# EasyEDA Pro project RK3568_DEV.epro, schematic Schematic1, sheets 25 to 27 of 27

## Sheets
25 RK809-5: Create Date: 2025-09-11; Page Name: RK809-5; Project Name: RK3568B2地瓜派; Update Date: 2025-09-11
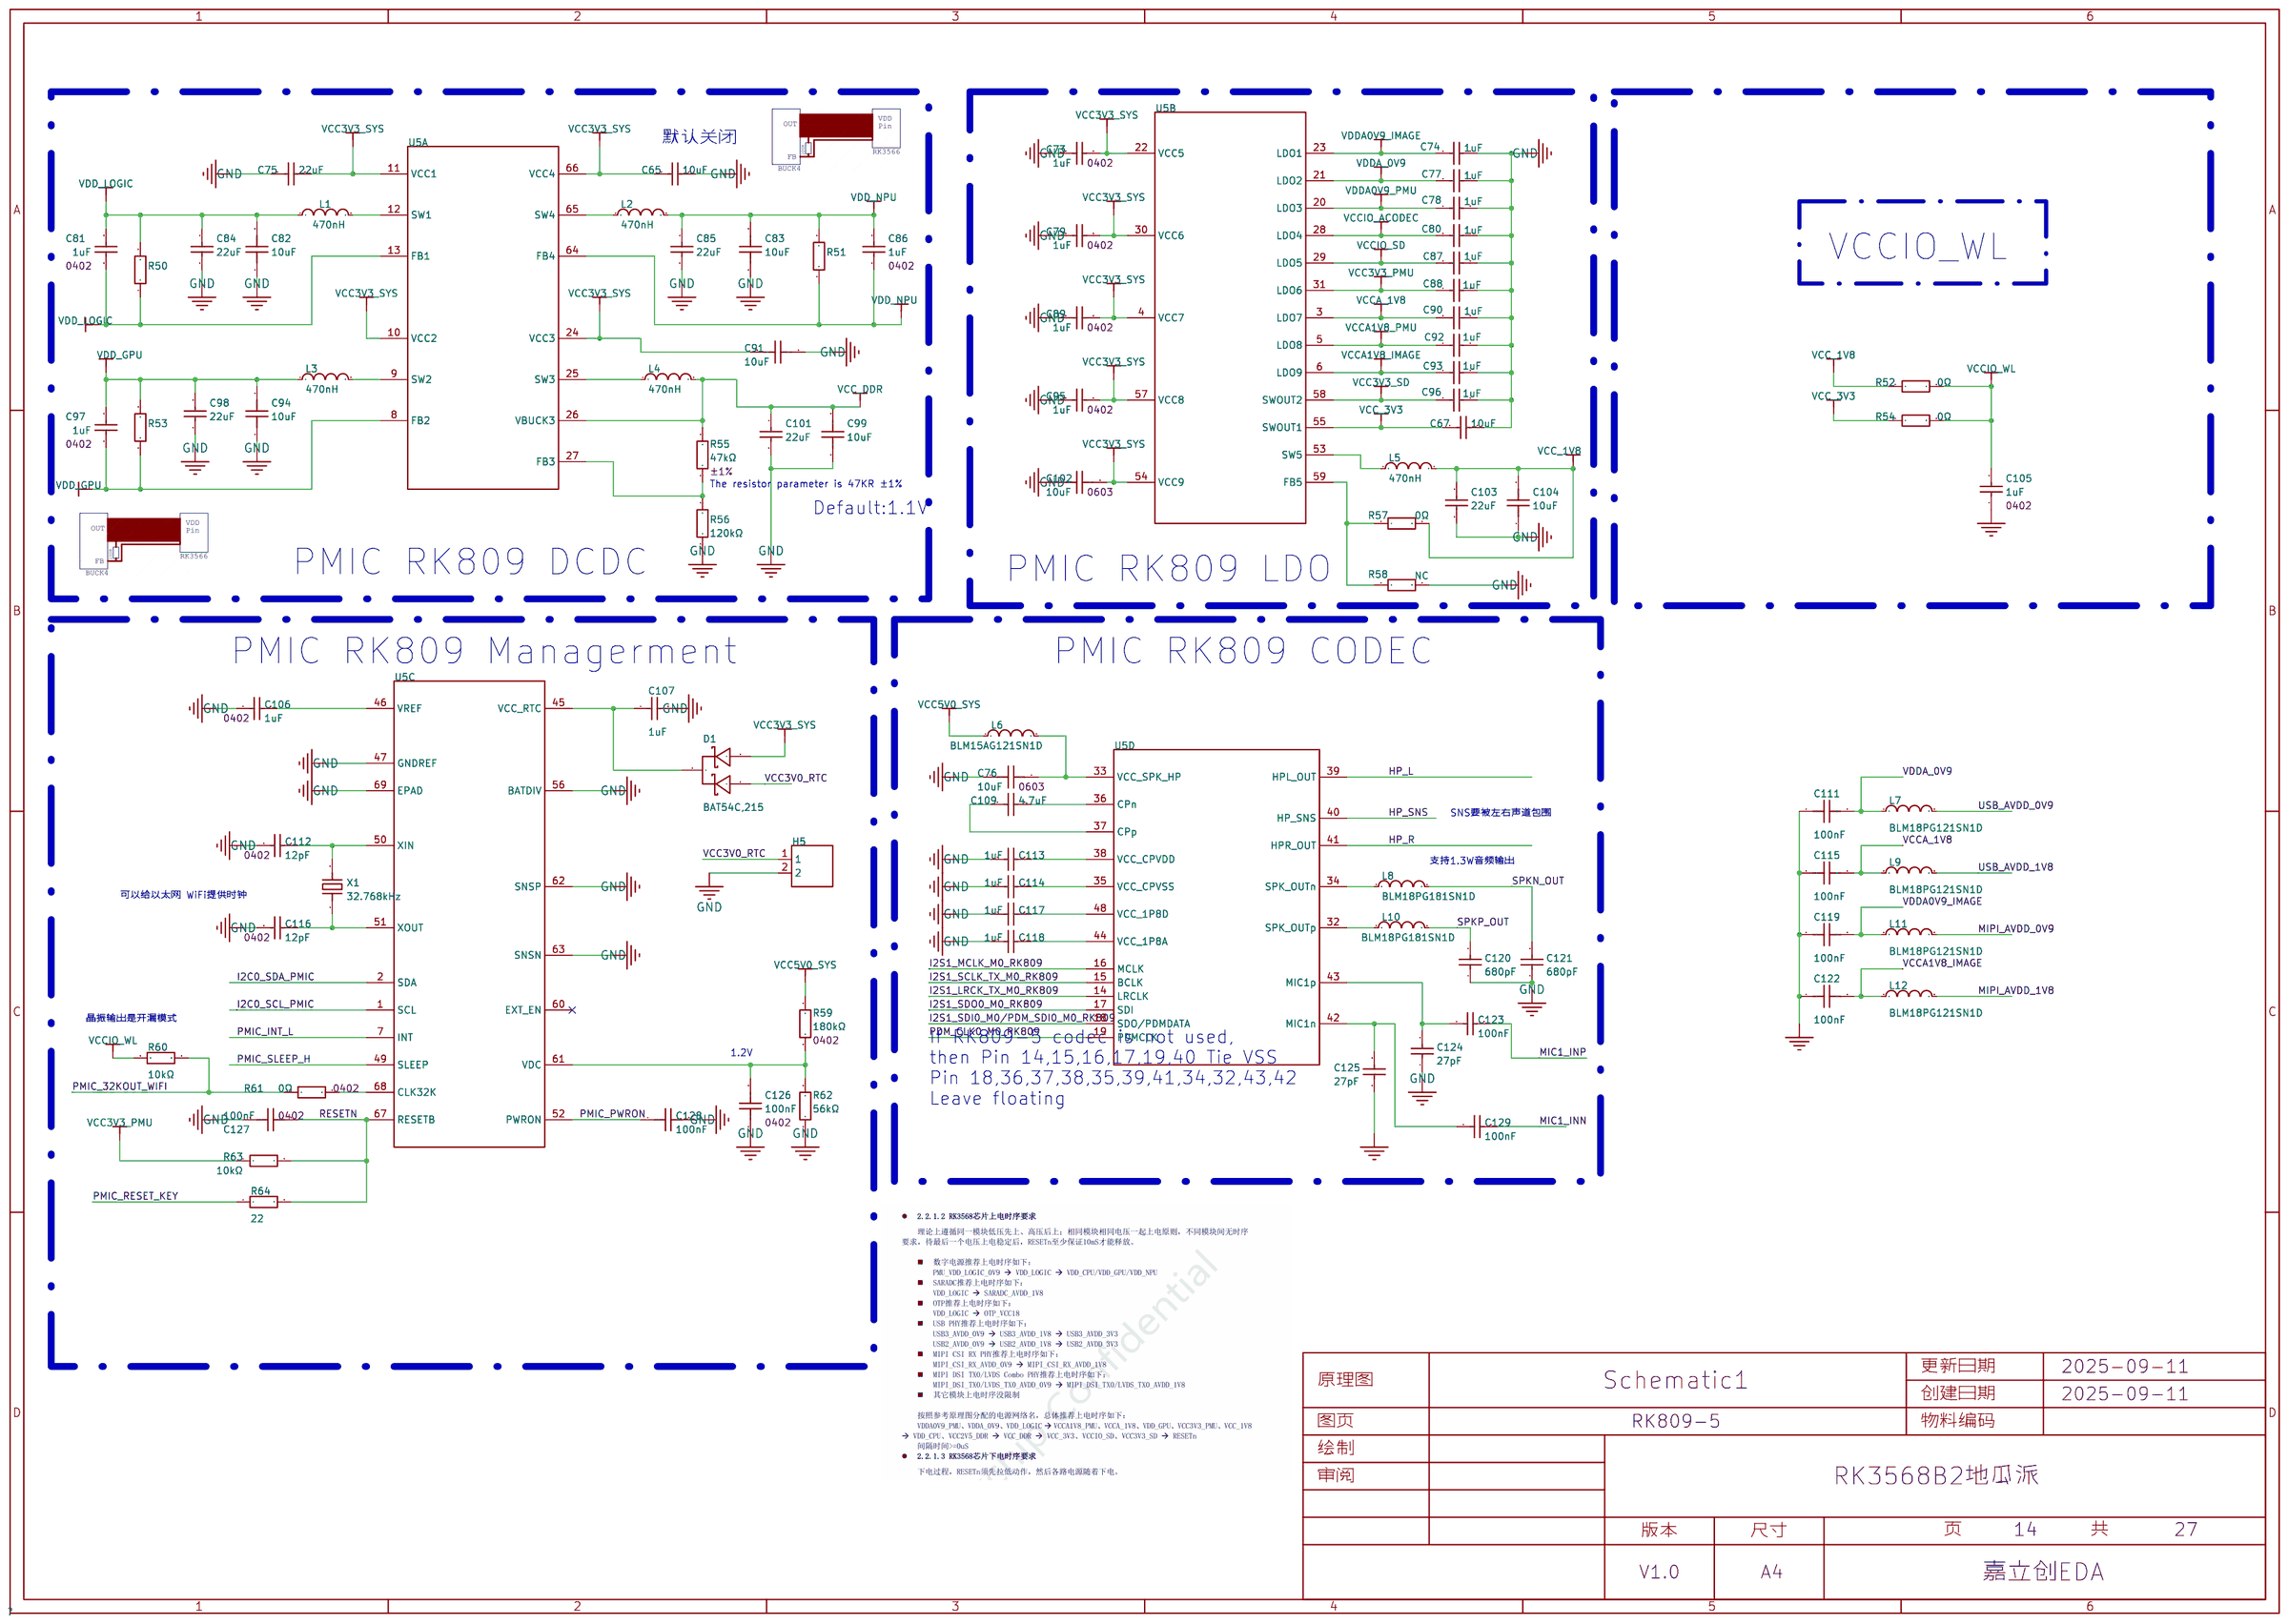
[diagram p24: RK809-5]
26 DCDC: Create Date: 2025-09-11; Page Name: DCDC; Project Name: RK3568B2地瓜派; Update Date: 2025-09-13
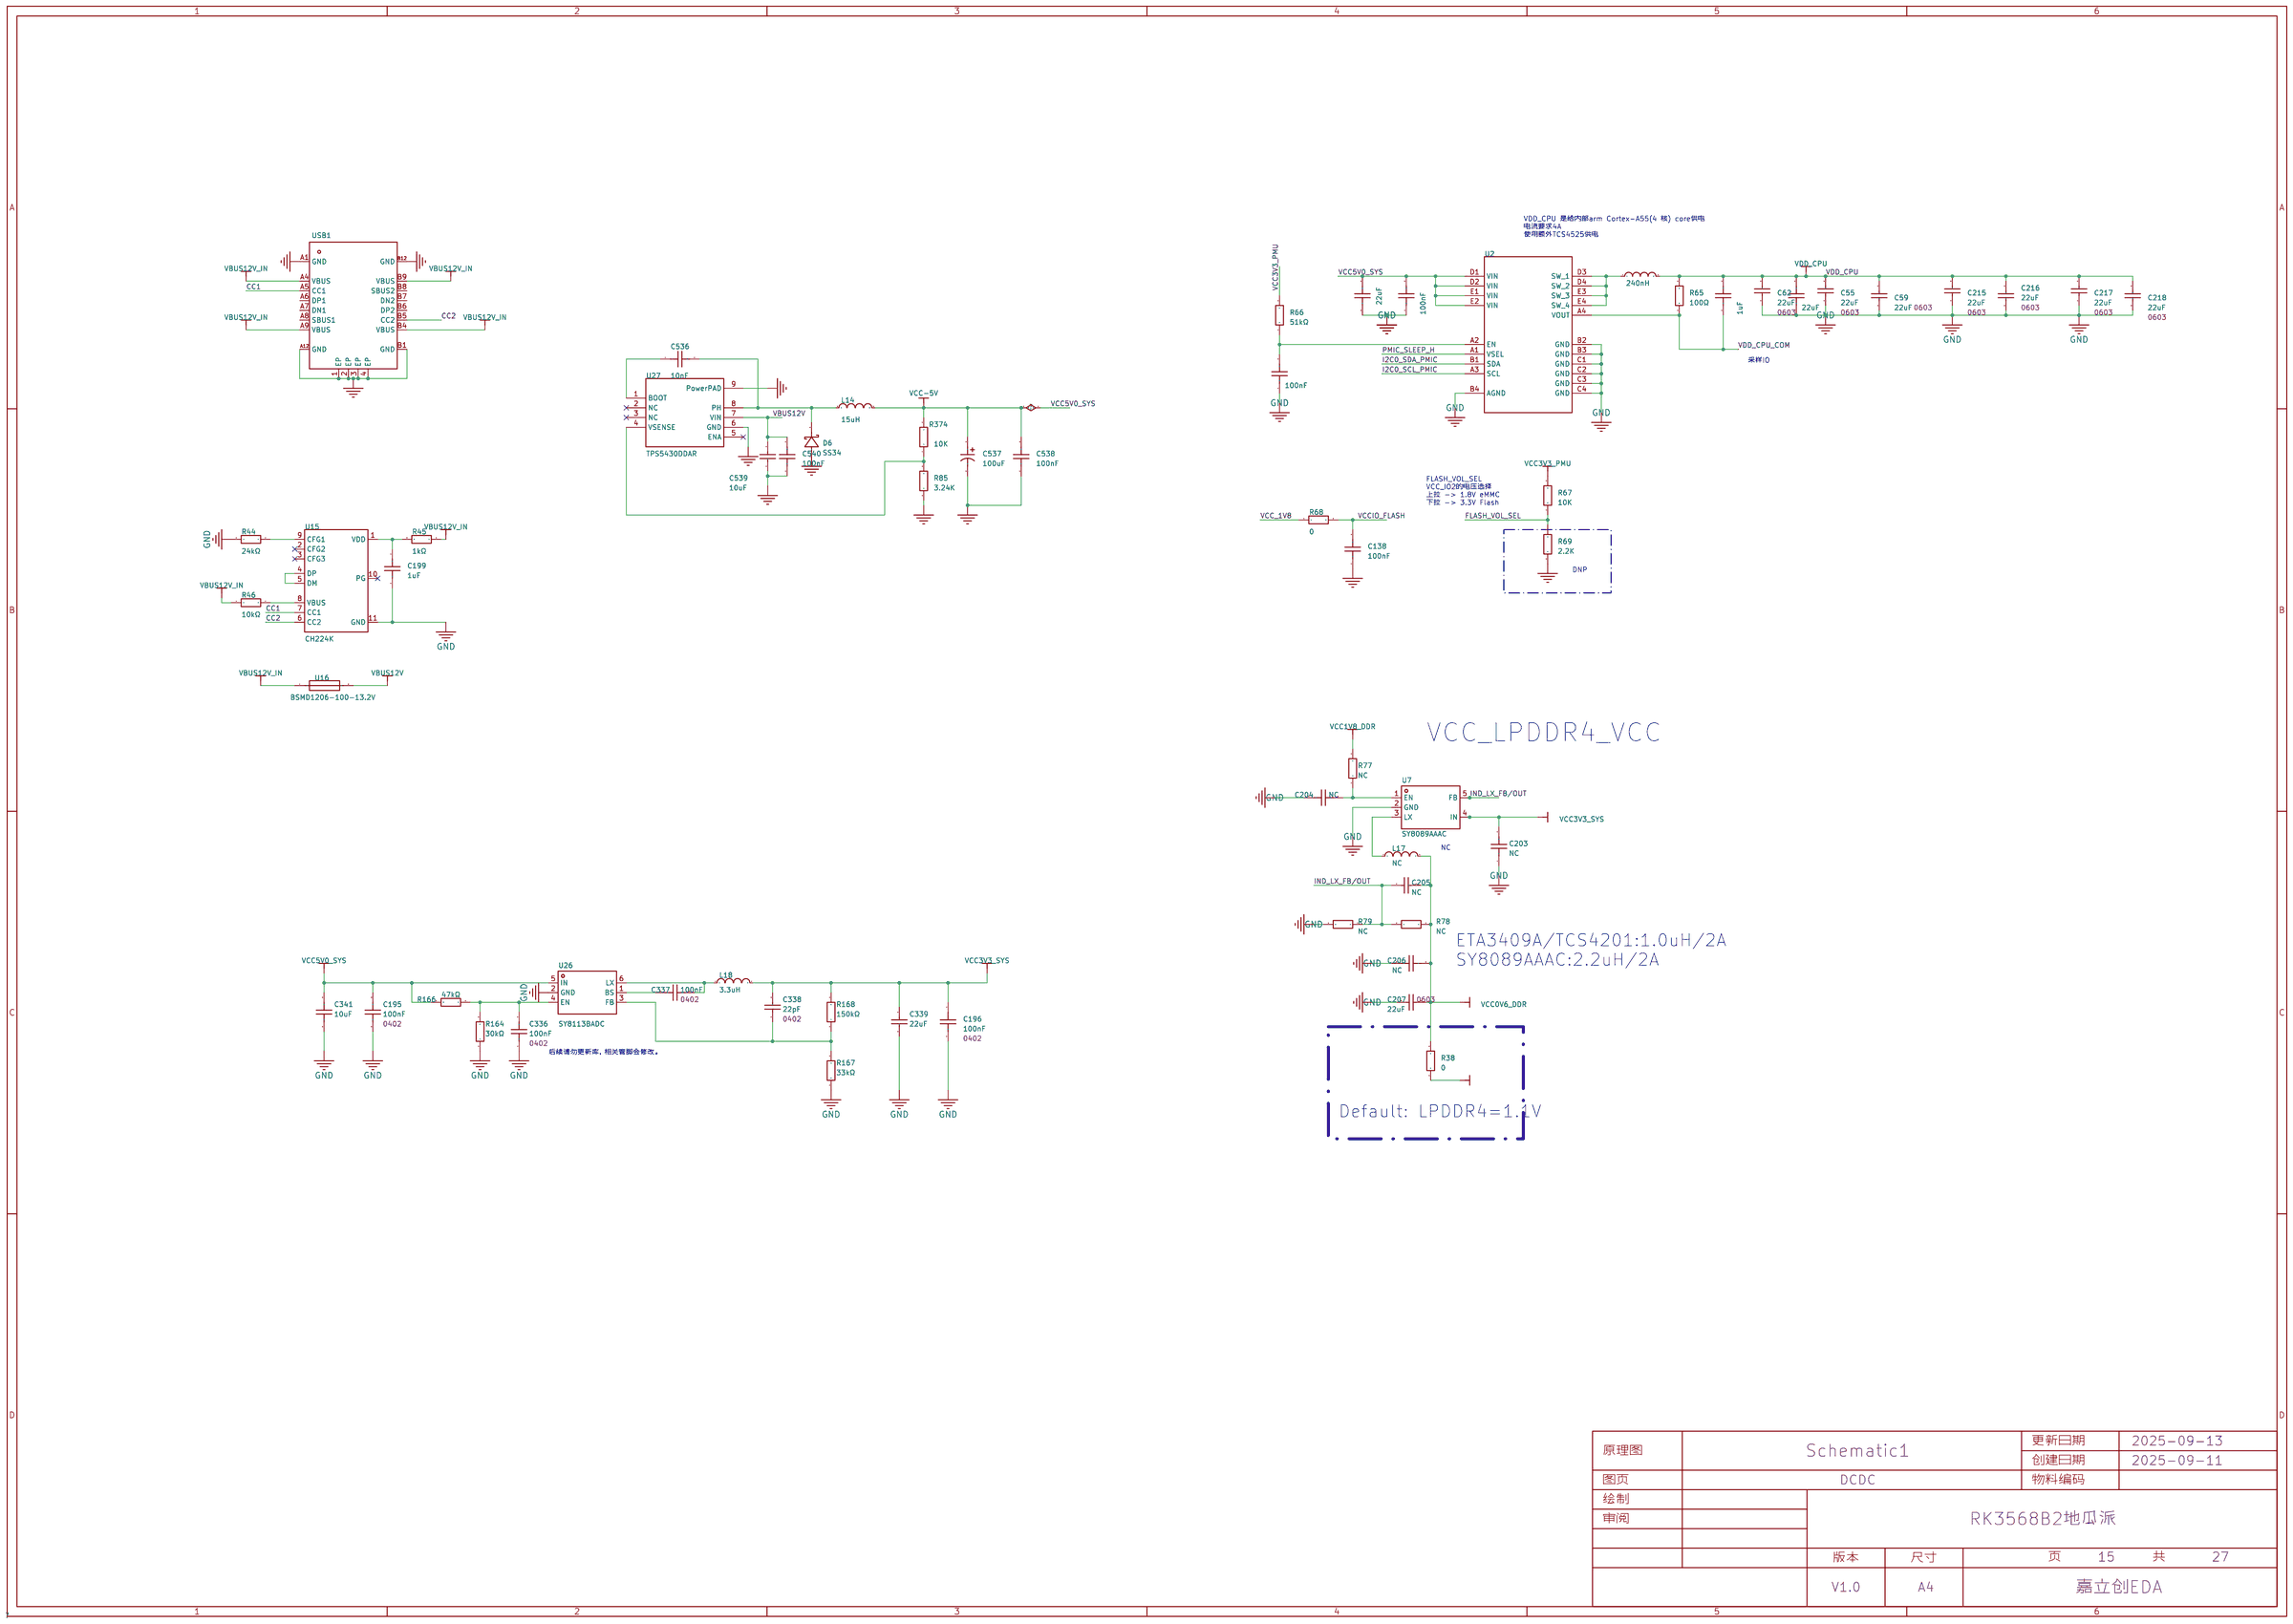
[diagram p25: DCDC]
27 RGMII: Create Date: 2025-09-11; Page Name: RGMII; Project Name: RK3568B2地瓜派; Update Date: 2025-09-23
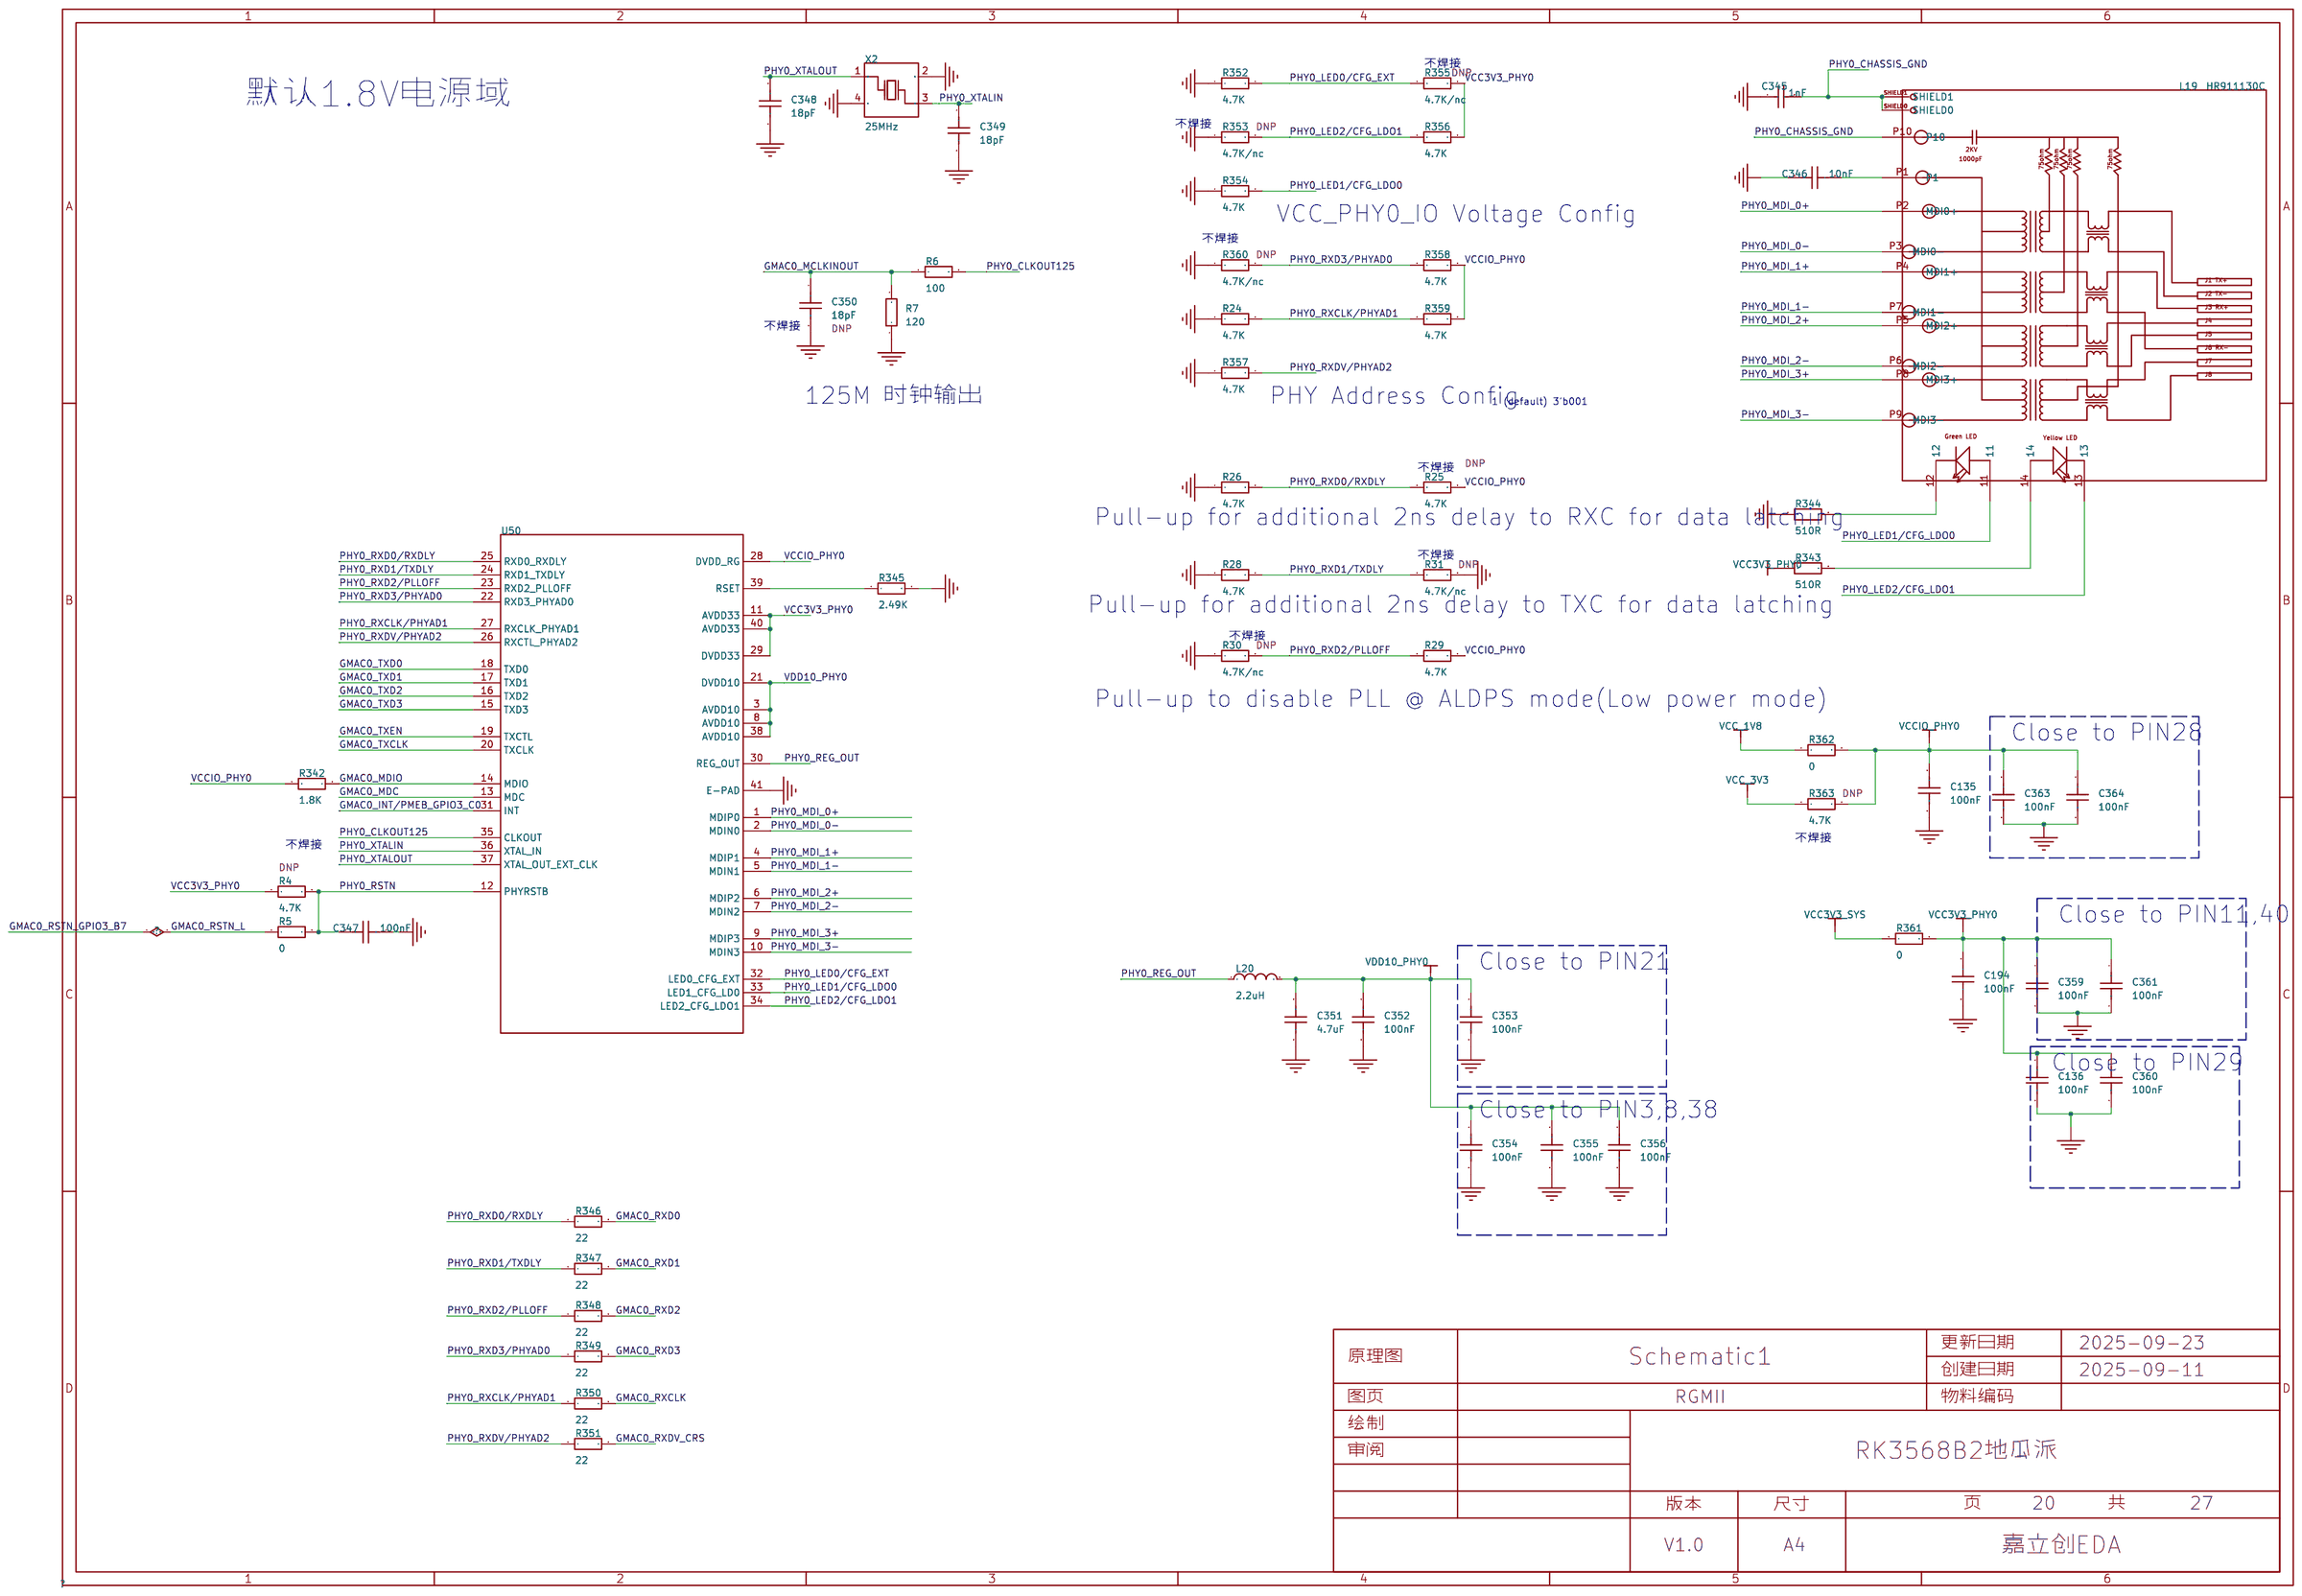
[diagram p26: RGMII]

## Parts
sheet DCDC
C55  22uF  [C0603_1]
C59  22uF  [C0603_1]
C62  22uF  [C0603_1]
C130  22uF  [c0603-nsk]
C131  100nF  [c0402-nsk]
C132  1uF  [c0402-nsk]
C134  22uF  [c0603-nsk]
C137  100nF  [c0402-nsk]
C138  100nF  [C0603]
C195  100nF  [R0402_1]
C196  100nF  [R0402_1]
C199  1uF  [C0402_1]
C203  NC  [R0603_1]  (no BOM)
C204  NC  [R0402_1]  (no BOM)
C205  NC  [R0402_1]  (no BOM)
C206  NC  [R0603_1]  (no BOM)
C207  22uF  [C0603_1]
C215  22uF  [C0603_1]
C216  22uF  [C0603_1]
C217  22uF  [C0603_1]
C218  22uF  [C0603_1]
C336  100nF  [R0402_1]
C337  100nF  [R0402_1]
C338  22pF  [R0402_1]
C339  22uF  [C0603_1]
C341  10uF  [C0603_2]
C536  10nF  [C0603]
C537  100uF  [CAP-SMD_BD6.3-L6.6-W6.6-RD]
C538  100nF  [C0603]
C539  10uF  [C1206]
C540  100nF  [C0603]
D6  SS34  [SMA_L4.3-W2.6-LS5.0-FD]
L13  240nH  [IND-SMD_L2.5-W2.0_WPN252012H]
L14  15uH  [IND-SMD_L7.3-W6.8]
L17  NC  [IND-SMD_L3.0-W3.0]  (no BOM)
L18  3.3uH  [IND-SMD_L4.4-W4.2]
R38  0  [R0603]
R44  24kΩ  [R0402]
R45  1kΩ  [R0402]
R46  10kΩ  [R0402]
R65  100Ω  [R0402]
R66  51kΩ  [R0402]
R67  10K  [R0402]
R68  0  [R0603]
R69  2.2K  [R0402]
R77  NC  [R0402_1]  (no BOM)
R78  NC  [R0402_1]  (no BOM)
R79  NC  [R0402_1]  (no BOM)
R85  3.24K  [R0603]
R164  30kΩ  [R0402_1]
R166  47kΩ  [R0402_1]
R167  33kΩ  [R0402_1]
R168  150kΩ  [R0402_2]
R374  10K  [R0603]
U2  -  [TCS4525]
U7  NC  [SOT-23-5_L3.0-W1.7-P0.95-LS2.8-BR]  (no BOM)
U15  CH224K  [ESSOP-10_L4.9-W3.9-P1.0-LS6.0-TL-EP]
U16  BSMD1206-100-13.2V  [F1206]
U26  SY8113BADC  [TSOT-23-6_L2.9-W1.6-P0.95-LS2.8-BR]
U27  TPS5430DDAR  [ESOP-8_L4.9-W3.9-P1.27-LS6.0-TL-EP]
USB1  -  [USB_TYPE-C-16P]
sheet RGMII
C135  100nF  [c0402-nsk]
C136  100nF  [c0402-nsk]
C194  100nF  [c0402-nsk]
C345  1nF  [C1206]
C346  10nF  [c0402-nsk]
C347  100nF  [c0402-nsk]
C348  18pF  [c0402-nsk]
C349  18pF  [c0402-nsk]
C350  18pF  [c0402-nsk]  (no BOM)
C351  4.7uF  [C0603]
C352  100nF  [c0402-nsk]
C353  100nF  [c0402-nsk]
C354  100nF  [c0402-nsk]
C355  100nF  [c0402-nsk]
C356  100nF  [c0402-nsk]
C359  100nF  [c0402-nsk]
C360  100nF  [c0402-nsk]
C361  100nF  [c0402-nsk]
C363  100nF  [c0402-nsk]
C364  100nF  [c0402-nsk]
L19  HR911130C  [RJ45-TH_HR911130C]
L20  2.2uH  [IND-SMD_L2.5-W2.0_MHCHL2520]
R4  4.7K  [R0402]  (no BOM)
R5  0  [R0402]
R6  100  [R0402]
R7  120  [R0402]
R24  4.7K  [R0402]
R25  4.7K  [R0402]  (no BOM)
R26  4.7K  [R0402]
R28  4.7K  [R0402]
R29  4.7K  [R0402]
R30  4.7K/nc  [R0402]  (no BOM)
R31  4.7K/nc  [R0402]  (no BOM)
R342  1.8K  [R0402]
R343  510R  [R0402]
R344  510R  [R0402]
R345  2.49K  [R0402]
R346  22  [R0402]
R347  22  [R0402]
R348  22  [R0402]
R349  22  [R0402]
R350  22  [R0402]
R351  22  [R0402]
R352  4.7K  [R0402]
R353  4.7K/nc  [R0402]  (no BOM)
R354  4.7K  [R0402]
R355  4.7K/nc  [R0402]  (no BOM)
R356  4.7K  [R0402]
R357  4.7K  [R0402]
R358  4.7K  [R0402]
R359  4.7K  [R0402]
R360  4.7K/nc  [R0402]  (no BOM)
R361  0  [R0603]
R362  0  [R0603]
R363  4.7K  [R0402]  (no BOM)
U50  -  [RTL8211F-CG]
X2  25MHz  [CRYSTAL-SMD_4P-L3.2-W2.5-BL_1]
sheet RK809-5
C65  10uF  [C0603_1]
C67  10uF  [C0603_1]
C73  1uF  [R0402_1]
C74  1uF  [R0402_1]
C75  22uF  [C0603_1]
C76  10uF  [C0603_2]
C77  1uF  [R0402_1]
C78  1uF  [R0402_1]
C79  1uF  [R0402_1]
C80  1uF  [R0402_1]
C81  1uF  [R0402_1]
C82  10uF  [C0603_2]
C83  10uF  [C0603_2]
C84  22uF  [C0603_1]
C85  22uF  [C0603_1]
C86  1uF  [R0402_1]
C87  1uF  [R0402_1]
C88  1uF  [R0402_1]
C89  1uF  [R0402_1]
C90  1uF  [R0402_1]
C91  10uF  [C0603_2]
C92  1uF  [R0402_1]
C93  1uF  [R0402_1]
C94  10uF  [C0603_2]
C95  1uF  [R0402_1]
C96  1uF  [R0402_1]
C97  1uF  [R0402_1]
C98  22uF  [C0603_1]
C99  10uF  [C0603_2]
C101  22uF  [C0603_1]
C102  10uF  [C0603_2]
C103  22uF  [C0603_1]
C104  10uF  [C0603_2]
C105  1uF  [R0402_1]
C106  1uF  [R0402_1]
C107  1uF  [R0402_1]
C109  4.7uF  [R0402_1]
C111  100nF  [R0402_3]
C112  12pF  [R0402_2]
C113  1uF  [R0402_1]
C114  1uF  [R0402_1]
C115  100nF  [R0402_3]
C116  12pF  [R0402_2]
C117  1uF  [R0402_1]
C118  1uF  [R0402_1]
C119  100nF  [R0402_3]
C120  680pF  [R0402_1]
C121  680pF  [R0402_1]
C122  100nF  [R0402_3]
C123  100nF  [R0402_1]
C124  27pF  [R0402_1]
C125  27pF  [R0402_1]
C126  100nF  [R0402_1]
C127  100nF  [R0402_1]
C128  100nF  [R0402_1]
C129  100nF  [R0402_1]
D1  BAT54C,215  [SOT-23-3_L2.9-W1.6-P1.90-LS2.8-BR]
H5  -  [HDR-TH_2P-P2.54-V-M-1]
L1  470nH  [IND-SMD_L2.0-W1.6_MHCHL201610A-1R0M-Q8A]
L2  470nH  [IND-SMD_L2.0-W1.6_MHCHL201610A-1R0M-Q8A]
L3  470nH  [IND-SMD_L2.0-W1.6_MHCHL201610A-1R0M-Q8A]
L4  470nH  [IND-SMD_L2.0-W1.6_MHCHL201610A-1R0M-Q8A]
L5  470nH  [IND-SMD_L2.0-W1.6_MHCHL201610A-1R0M-Q8A]
L6  BLM15AG121SN1D  [L0402]
L7  BLM18PG121SN1D  [L0603_1]
L8  BLM18PG181SN1D  [L0603]
L9  BLM18PG121SN1D  [L0603_1]
L10  BLM18PG181SN1D  [L0603]
L11  BLM18PG121SN1D  [L0603_1]
L12  BLM18PG121SN1D  [L0603_1]
R50  0402WGF1000TCE  [R0402_1]
R51  0402WGF1000TCE  [R0402_1]
R52  0Ω  [R0402_1]
R53  0402WGF1000TCE  [R0402_1]
R54  0Ω  [R0402_1]  (no BOM)
R55  47kΩ  [R0402_1]
R56  120kΩ  [R0402_1]
R57  0Ω  [R0402_1]
R58  NC  [R0402_1]  (no BOM)
R59  180kΩ  [R0402_1]
R60  10kΩ  [R0402_1]
R61  0Ω  [R0402_1]
R62  56kΩ  [R0402_1]
R63  10kΩ  [R0402_1]
R64  22  [R0402]
U5  -  [RK809-5]  (sections 1,2,3,4)
X1  32.768kHz  [CRYSTAL-SMD_L3.2-W1.5-1]

## Library data of the parts
C55 C59 C62 C65 C67 C75 C84 C85 C98 C101 C103 C130 C134 C207 C215-C218 C339 = CL10A226MQ8NRNC: 容值:22uF;精度:±20%;额定电压:6.3V;材质(温度系数):X5R;; LCSC Part Name: 22uF ±20% 6.3V; Supplier Part: C59461; Manufacturer: SAMSUNG(三星); Supplier Footprint: 0603; JLCPCB Part Class: Basic Part; Datasheet: https://atta.szlcsc.com/upload/public/pdf/source/20160218/1457707763339.pdf; Supplier: LCSC; Tolerance: ±20%; Voltage Rated: 6.3V; Temperature Coefficient: X5R
C131 C132 C137 = CC0603KRX7R9BB104: 容值:100nF;精度:±10%;额定电压:50V;材质(温度系数):X7R;; LCSC Part Name: 100nF ±10% 50V; Supplier Part: C14663; Manufacturer: YAGEO(国巨); Supplier Footprint: 0603; JLCPCB Part Class: Basic Part; Datasheet: https://atta.szlcsc.com/upload/public/pdf/source/20180910/C282072_33301C7F631E79921B82A8DAC6BCC5B3.pdf; Supplier: LCSC; Tolerance: ±10%; Voltage Rated: 50V; Temperature Coefficient: X7R
C138 C351 C536 C538 C540 = CAP_0603: Supplier Footprint: 0603
C126-C128 C195 C196 C336 C337 = CL05B104KB54PNC: 容值:100nF;精度:±10%;额定电压:50V;材质(温度系数):X7R;; LCSC Part Name: 100nF ±10% 50V; Supplier Part: C307331; Manufacturer: SAMSUNG(三星); Supplier Footprint: 0402; JLCPCB Part Class: Basic Part; Datasheet: https://atta.szlcsc.com/upload/public/pdf/source/20181009/C307331_222F7C870FD3EA5F46F538B483443886.pdf; Supplier: LCSC; Tolerance: ±10%; Voltage Rated: 50V; Temperature Coefficient: X7R
C199 = CL10A105KO8NNNC: 容值:1uF;精度:±10%;额定电压:16V;材质(温度系数):X5R;; LCSC Part Name: 1uF ±10% 16V; Supplier Part: C1592; Manufacturer: SAMSUNG(三星); Supplier Footprint: 0603; JLCPCB Part Class: Extended Part; Datasheet: https://atta.szlcsc.com/upload/public/pdf/source/20220919/9FBE606BE0D9532D730F292EB26DC5BB.pdf; Supplier: LCSC; Tolerance: ±10%; Voltage Rated: 16V; Temperature Coefficient: X5R
C203 C206 = 0603X106M100CT: 容值:10uF;精度:±20%;额定电压:10V;材质(温度系数):X5R;; LCSC Part Name: 10uF ±20% 10V; Manufacturer: Walsin(华新科); Supplier Footprint: 0603; JLCPCB Part Class: 扩展库; Datasheet: https://atta.szlcsc.com/upload/public/pdf/source/20161226/1482720147964.pdf; Supplier: LCSC; Tolerance: ±20%; Voltage Rated: 10V; Temperature Coefficient: X5R
C204 = CL05B104KB54PNC: 容值:100nF;精度:±10%;额定电压:50V;材质(温度系数):X7R;; LCSC Part Name: 100nF ±10% 50V; Manufacturer: SAMSUNG(三星); Supplier Footprint: 0402; JLCPCB Part Class: Basic Part; Datasheet: https://atta.szlcsc.com/upload/public/pdf/source/20181009/C307331_222F7C870FD3EA5F46F538B483443886.pdf; Supplier: LCSC; Tolerance: ±10%; Voltage Rated: 50V; Temperature Coefficient: X7R
C205 = 0402CG101J500NT: 容值:100pF;精度:±5%;额定电压:50V;材质(温度系数):C0G;; LCSC Part Name: 100pF ±5% 50V; Manufacturer: FH(风华); Supplier Footprint: 0402; JLCPCB Part Class: Basic Part; Datasheet: https://atta.szlcsc.com/upload/public/pdf/source/20170923/C1546_1506149265265988353.pdf; Supplier: LCSC; Tolerance: ±5%; Voltage Rated: 50V; Temperature Coefficient: C0G
C338 = 0402CG220J500NT: 容值:22pF;精度:±5%;额定电压:50V;材质(温度系数):C0G;; LCSC Part Name: 22pF ±5% 50V; Supplier Part: C1555; Manufacturer: FH(风华); Supplier Footprint: 0402; JLCPCB Part Class: Basic Part; Datasheet: https://atta.szlcsc.com/upload/public/pdf/source/20170923/C1555_1506149269156988362.pdf; Supplier: LCSC; Tolerance: ±5%; Voltage Rated: 50V; Temperature Coefficient: C0G
C76 C82 C83 C91 C94 C99 C102 C104 C341 = CL10A106KP8NNNC: 容值:10uF;精度:±10%;额定电压:10V;材质(温度系数):X5R;; LCSC Part Name: 10uF ±10% 10V; Supplier Part: C19702; Manufacturer: SAMSUNG(三星); Supplier Footprint: 0603; JLCPCB Part Class: Basic Part; Datasheet: https://atta.szlcsc.com/upload/public/pdf/source/20160103/1457707703378.pdf; Supplier: LCSC; Tolerance: ±10%; Voltage Rated: 10V; Temperature Coefficient: X5R
C537 = MA35V100M6X8: 容值:100uF;精度:±20%;额定电压:35V;纹波电流:2.9A@100kHz;等效串联电阻(ESR):30mΩ@100kHz;类型:聚合物;; LCSC Part Name: 100uF ±20% 35V; Supplier Part: C46550467; Manufacturer: 捷而瑞; Supplier Footprint: SMD,D6.3xL7.7mm; JLCPCB Part Class: 扩展库; Datasheet: https://item.szlcsc.com/datasheet/MA35V100M6X8/48680161.html; Supplier: LCSC; Tolerance: ±20%; Voltage Rating: 35V; Ripple Current: 2.9A@100kHz; Equivalent Series Resistance(ESR): 30mΩ@100kHz; Type: 聚合物; Diameter: 6.3mm; Height - Seated (Max): 7mm; Lifetime: 2000hrs@105℃; Operating Temperature: -55℃~+105℃
C539 = CL31A106KBHNNNE: 容值:10uF;精度:±10%;额定电压:50V;温度系数:X5R;; LCSC Part Name: 10uF ±10% 50V; Supplier Part: C13585; Manufacturer: SAMSUNG(三星); Supplier Footprint: 1206; JLCPCB Part Class: 基础库; Datasheet: https://item.szlcsc.com/datasheet/CL31A106KBHNNNE/14236.html; Supplier: LCSC; Tolerance: ±10%; Voltage Rating: 50V; Temperature Coefficient: X5R
D6 = SS34_C7420365: 二极管配置:独立式;正向压降(Vf):550mV@3.0A;直流反向耐压(Vr):40V;平均整流电流(Io):3A;; LCSC Part Name: 电压:40V 电流:3A; Supplier Part: C7420365; Manufacturer: 宏迦橙; Supplier Footprint: SMA(DO-214AC); JLCPCB Part Class: 扩展库; Datasheet: https://atta.szlcsc.com/upload/public/pdf/source/20230828/75438452AEE6C276EDA92B2AF599BE05.pdf; Supplier: LCSC; Diode Configuration: 独立式; Forward Voltage (Vf@If): 550mV@3.0A; Reverse Voltage (Vr): 40V; Average Rectified Current (Io): 3A; Reverse Leakage Current (Ir): 200uA@40V; Peak forward surge current: 80A
L13 = WPN252012HR24MT: LCSC Part Name: 240nH ±20%; Supplier Part: C305274; Manufacturer: Sunlord(顺络); Supplier Footprint: SMD,2.5x2.0x1.2mm; JLCPCB Part Class: Extended Part; Supplier: LCSC
L14 = FXL0630-100-M: 电感值:10uH;精度:±20%;额定电流:4.5A;饱和电流(Isat):5.5A;类型:一体成型电感;; LCSC Part Name: 10uH ±20% 5.5A; Supplier Part: C167223; Manufacturer: cjiang(长江微电); Supplier Footprint: SMD,6.6x7mm; JLCPCB Part Class: 扩展库; Datasheet: https://atta.szlcsc.com/upload/public/pdf/source/20240426/3189EA8206330E2108542F9E34E540E7.pdf; Supplier: LCSC; Tolerance: ±20%; Rated Current: 4.5A; Saturation Current (Isat): 5.5A; DC Resistance (DCR): 68mΩ; Type: 一体成型电感
L17 = SWPA3015S2R2MT: 电感值:2.2uH;精度:±20%;额定电流:2A;直流电阻(DCR):-;; LCSC Part Name: 2.2uH ±20% 2A; Manufacturer: Sunlord(顺络); Supplier Footprint: SMD; JLCPCB Part Class: Extended Part; Datasheet: https://atta.szlcsc.com/upload/public/pdf/source/20210916/AC798BA7E846B7D0B6818F45CD84DB0B.pdf; Supplier: LCSC; Tolerance: ±20%; Rated Current: 2A
L18 = MWSA0402S-3R3MT: 额定电流:3.3A;精度:±20%;电感值:3.3uH;直流电阻(DCR):87mΩ;; LCSC Part Name: 3.3uH ±20%; Supplier Part: C408336; Manufacturer: Sunlord(顺络); Supplier Footprint: SMD; JLCPCB Part Class: Extended Part; Datasheet: https://atta.szlcsc.com/upload/public/pdf/source/20190729/C408336_17B5BB1DF2845DE8F323BD9CE9EEFEBA.pdf; Supplier: LCSC; Height: 2mm; Rated Current: 3.3A; Width: 4.4mm; Tolerance: ±20%; DC Resistance (DCR): 87mΩ; Length: 4.2mm
R38 R68 R85 R361 R362 R374 = Res_0603: Supplier Footprint: 0603
R44 = 0603WAF2402T5E: 电阻类型:厚膜电阻;阻值:24kΩ;精度:±1%;功率:100mW;最大工作电压:75V;温度系数:±100ppm/℃;; LCSC Part Name: 24kΩ ±1% 100mW 厚膜电阻; Supplier Part: C23352; Manufacturer: UNI-ROYAL(厚声); Supplier Footprint: 0603; JLCPCB Part Class: Basic Part; Datasheet: https://atta.szlcsc.com/upload/public/pdf/source/20200306/C422600_1E6D84923E4A46A82E41ADD87F860B5C.pdf; Supplier: LCSC; Type: 厚膜电阻; Tolerance: ±1%; Power(Watts): 100mW; Overload Voltage (Max): 75V; Temperature Coefficient: ±100ppm/℃; Operating Temperature Range: -55℃~+155℃
R45 = 0603WAF1001T5E: 电阻类型:厚膜电阻;阻值:1kΩ;精度:±1%;功率:100mW;最大工作电压:75V;温度系数:±100ppm/℃;; LCSC Part Name: 1kΩ ±1% 100mW 厚膜电阻; Supplier Part: C21190; Manufacturer: UNI-ROYAL(厚声); Supplier Footprint: 0603; JLCPCB Part Class: Basic Part; Datasheet: https://atta.szlcsc.com/upload/public/pdf/source/20200306/C422600_1E6D84923E4A46A82E41ADD87F860B5C.pdf; Supplier: LCSC; Type: 厚膜电阻; Tolerance: ±1%; Power(Watts): 100mW; Overload Voltage (Max): 75V; Temperature Coefficient: ±100ppm/℃; Operating Temperature Range: -55℃~+155℃
R46 = 0603WAF1002T5E: 电阻类型:厚膜电阻;阻值:10kΩ;精度:±1%;功率:100mW;最大工作电压:75V;温度系数:±100ppm/℃;; LCSC Part Name: 厚膜电阻 10kΩ ±1% 100mW; Supplier Part: C25804; Manufacturer: UNI-ROYAL(厚声); Supplier Footprint: 0603; JLCPCB Part Class: Basic Part; Datasheet: https://atta.szlcsc.com/upload/public/pdf/source/20200306/C422600_1E6D84923E4A46A82E41ADD87F860B5C.pdf; Supplier: LCSC; Type: 厚膜电阻; Tolerance: ±1%; Power(Watts): 100mW; Overload Voltage (Max): 75V; Temperature Coefficient: ±100ppm/℃; Operating Temperature Range: -55℃~+155℃
R5-R7 R24 R25 R29 R64-R67 R69 R342-R352 R354 R356-R359 = Res_0402: Supplier Footprint: 0402
R77 = 0402WGF2002TCE: 电阻类型:厚膜电阻;阻值:20kΩ;精度:±1%;功率:62.5mW;温度系数:±100ppm/℃;最大工作电压:50V;工作温度范围:-55℃~+155℃;; LCSC Part Name: 20kΩ ±1% 62.5mW; Manufacturer: UNI-ROYAL(厚声); Supplier Footprint: 0402; JLCPCB Part Class: Basic Part; Datasheet: https://atta.szlcsc.com/upload/public/pdf/source/20200306/C422600_1E6D84923E4A46A82E41ADD87F860B5C.pdf; Supplier: LCSC; Type: 厚膜电阻; Tolerance: ±1%; Power(Watts): 62.5mW; Temperature Coefficient: ±100ppm/℃; Overload Voltage (Max): 50V; Operating Temperature Range: -55℃~+155℃
R78 = 0402WGF2001TCE: 电阻类型:厚膜电阻;阻值:2kΩ;精度:±1%;功率:62.5mW;温度系数:±100ppm/℃;最大工作电压:50V;工作温度范围:-55℃~+155℃;; LCSC Part Name: 2kΩ ±1% 62.5mW; Manufacturer: UNI-ROYAL(厚声); Supplier Footprint: 0402; JLCPCB Part Class: Basic Part; Datasheet: https://atta.szlcsc.com/upload/public/pdf/source/20200306/C422600_1E6D84923E4A46A82E41ADD87F860B5C.pdf; Supplier: LCSC; Type: 厚膜电阻; Tolerance: ±1%; Power(Watts): 62.5mW; Temperature Coefficient: ±100ppm/℃; Overload Voltage (Max): 50V; Operating Temperature Range: -55℃~+155℃
R79 = 0402WGF1003TCE: 电阻类型:厚膜电阻;阻值:100kΩ;精度:±1%;功率:62.5mW;温度系数:±100ppm/℃;最大工作电压:50V;工作温度范围:-55℃~+155℃;; LCSC Part Name: 100kΩ ±1% 62.5mW; Manufacturer: UNI-ROYAL(厚声); Supplier Footprint: 0402; JLCPCB Part Class: Basic Part; Datasheet: https://atta.szlcsc.com/upload/public/pdf/source/20200306/C422600_1E6D84923E4A46A82E41ADD87F860B5C.pdf; Supplier: LCSC; Type: 厚膜电阻; Tolerance: ±1%; Power(Watts): 62.5mW; Temperature Coefficient: ±100ppm/℃; Overload Voltage (Max): 50V; Operating Temperature Range: -55℃~+155℃
R164 = RC0402FR-0730KL: 电阻类型:厚膜电阻;阻值:30kΩ;精度:±1%;功率:62.5mW;; LCSC Part Name: 30kΩ ±1% 62.5mW; Supplier Part: C138008; Manufacturer: YAGEO(国巨); Supplier Footprint: 0402; JLCPCB Part Class: Extended Part; Datasheet: https://atta.szlcsc.com/upload/public/pdf/source/20171107/C138008_15100516356731096935.pdf; Supplier: LCSC; Type: 厚膜电阻; Tolerance: ±1%; Power(Watts): 62.5mW; Temperature Coefficient: ±100ppm/℃; Overload Voltage (Max): 50V; Operating Temperature Range: -55℃~+155℃
R166 = 0402WGF4702TCE: 电阻类型:厚膜电阻;阻值:47kΩ;精度:±1%;功率:62.5mW;; LCSC Part Name: 47kΩ ±1% 62.5mW; Supplier Part: C25792; Manufacturer: UNI-ROYAL(厚声); Supplier Footprint: 0402; JLCPCB Part Class: Basic Part; Datasheet: https://atta.szlcsc.com/upload/public/pdf/source/20200306/C422600_1E6D84923E4A46A82E41ADD87F860B5C.pdf; Supplier: LCSC; Type: 厚膜电阻; Tolerance: ±1%; Power(Watts): 62.5mW; Temperature Coefficient: ±100ppm/℃; Overload Voltage (Max): 50V; Operating Temperature Range: -55℃~+155℃
R167 = 0402WGF5102TCE: 电阻类型:厚膜电阻;阻值:51kΩ;精度:±1%;功率:62.5mW;; LCSC Part Name: 51kΩ ±1% 62.5mW; Supplier Part: C25794; Manufacturer: UNI-ROYAL(厚声); Supplier Footprint: 0402; JLCPCB Part Class: Basic Part; Datasheet: https://atta.szlcsc.com/upload/public/pdf/source/20200306/C422600_1E6D84923E4A46A82E41ADD87F860B5C.pdf; Supplier: LCSC; Type: 厚膜电阻; Tolerance: ±1%; Power(Watts): 62.5mW; Temperature Coefficient: ±100ppm/℃; Overload Voltage (Max): 50V; Operating Temperature Range: -55℃~+155℃
R168 = RC0402FR-07232KL: 电阻类型:厚膜电阻;阻值:232kΩ;精度:±1%;功率:62.5mW;; LCSC Part Name: 232kΩ ±1% 62.5mW; Supplier Part: C309542; Manufacturer: YAGEO(国巨); Supplier Footprint: 0402; JLCPCB Part Class: Extended Part; Datasheet: https://atta.szlcsc.com/upload/public/pdf/source/20181009/C309542_CA3F4488430805647C87B9489F02B718.pdf; Supplier: LCSC; Type: 厚膜电阻; Tolerance: ±1%; Power(Watts): 62.5mW; Temperature Coefficient: ±100ppm/℃; Overload Voltage (Max): 50V; Operating Temperature Range: -55℃~+155℃
U2 = TCS4525_WT: 高频，高电流同步降压DC-DC模块; Check: false
U7 = SY8089AAAC: 功能类型:降压型;同步整流:-;输出通道数:-;拓扑结构:-;输入电压:-;输出电流(最大值):-;开关频率:-;; LCSC Part Name: 降压型; Supplier Part: C78988; Manufacturer: silergy(矽力杰); Supplier Footprint: SOT-23-5; JLCPCB Part Class: Extended Part; Datasheet: https://atta.szlcsc.com/upload/public/pdf/source/20210826/394049C81A2AF57A190C26FDBC282657.pdf; Supplier: LCSC; Function: 降压型
U15 = CH224K: 应用功能:USB充电芯片;; LCSC Part Name: USB PD等多快充协议受电芯片CH224; Supplier Part: C970725; Manufacturer: WCH(南京沁恒); Supplier Footprint: ESSOP-10-150mil-1mm; JLCPCB Part Class: 扩展库; Datasheet: https://atta.szlcsc.com/upload/public/pdf/source/20240313/43C2AFDDBDD1F65B60386D2CCAB0811B.pdf; Supplier: LCSC; Applications Function: USB充电芯片
U16 = BSMD1206-100-13.2V: 最大电压:13.2V;最大电流:100A;保持电流:1A;跳闸电流:1.8A;; LCSC Part Name: 13.2V 1A 1206自恢复; Supplier Part: C883130; Manufacturer: BHFUSE(佰宏); Supplier Footprint: 1206; JLCPCB Part Class: Extended Part; Datasheet: https://atta.szlcsc.com/upload/public/pdf/source/20230512/E419278EC8529AAF514173EF221BCF4B.pdf; Supplier: LCSC; Operating Voltage (Max): 13.2V; Current Rating (Max): 100A; Hold Current: 1A; Trip Current: 1.8A; Power Dissipation: 800mW; Resistance - Initial (Ri) (Min): 50mΩ; Resistance - Post Trip (R1) (Max): 270mΩ; Maximum Time to Trip: 300ms; Operating Temperature: -40℃~+85℃
U26 = SY8113BADC: 功能类型:降压型;同步整流:-;输出通道数:-;拓扑结构:-;输入电压:-;输出电流(最大值):-;开关频率:-;; LCSC Part Name: 降压型; Supplier Part: C78989; Manufacturer: silergy(矽力杰); Supplier Footprint: TSOT-23-6; JLCPCB Part Class: Extended Part; Datasheet: https://atta.szlcsc.com/upload/public/pdf/source/20161125/1480067827505.pdf; Supplier: LCSC; Function: 降压型
U27 = TPS5430DDAR: 功能类型:降压型;输出类型:可调;工作电压:5.5V~36V;输出电压:1.221V~32.04V;输出电流:3A;; LCSC Part Name: 宽输入范围、3A输出电流的降压转换器; Supplier Part: C9864; Manufacturer: TI(德州仪器); Supplier Footprint: SOIC-8-EP; JLCPCB Part Class: 基础库; Datasheet: https://www.ti.com/cn/lit/gpn/tps5430; Supplier: LCSC; Function: 降压型; Output Type: 可调; Input Voltage: 5.5V~36V; Output Voltage: 1.221V~32.04V; Output Current: 3A; Switching Frequency: 500kHz; Operating Temperature: -40℃~+125℃@(TJ); Synchronous Rectification: 否; Number of Outputs: 1; Topology: 降压式; Switch tube (built-in/external): 内置
USB1 = USB_TYPE-C-16P: Supplier Footprint: SMD
C135 C136 C194 C346-C349 C352-C356 C359-C361 C363 C364 = CL10A105KB8NNNC: 容值:1uF;精度:±10%;额定电压:50V;材质(温度系数):X5R;; LCSC Part Name: 1uF ±10% 50V; Supplier Part: C15849; Manufacturer: SAMSUNG(三星); Supplier Footprint: 0603; JLCPCB Part Class: Basic Part; Datasheet: https://atta.szlcsc.com/upload/public/pdf/source/20160103/1457707679084.pdf; Supplier: LCSC; Tolerance: ±10%; Voltage Rated: 50V; Temperature Coefficient: X5R
C345 = 1206B102K202NT: 容值:1nF;精度:±10%;额定电压:2kV;温度系数:X7R;; LCSC Part Name: 1nF ±10% 2kV; Supplier Part: C9196; Manufacturer: FH(风华); Supplier Footprint: 1206; JLCPCB Part Class: 基础库; Datasheet: https://atta.szlcsc.com/upload/public/pdf/source/20200305/C486355_26A10D38EF8C2A5C37091D0039909270.pdf; Supplier: LCSC; Tolerance: ±10%; Voltage Rating: 2kV; Temperature Coefficient: X7R
C350 = CL10A105KB8NNNC: 容值:1uF;精度:±10%;额定电压:50V;材质(温度系数):X5R;; LCSC Part Name: 1uF ±10% 50V; Supplier Part: C15849; Manufacturer: SAMSUNG(三星); Supplier Footprint: 0603; JLCPCB Part Class: Basic Part; Datasheet: https://atta.szlcsc.com/upload/public/pdf/source/20160103/1457707679084.pdf; Supplier: LCSC; Tolerance: ±10%; Voltage Rated: 50V; Temperature Coefficient: X5R; Comment: DNP
L19 = HR911130C: 连接器类型:RJ45插座;端口数量:1;安装方式:弯插;屏蔽:有屏蔽;LED:带LED;等级:-;工作温度范围:-;; LCSC Part Name: 弯插 带LED; Supplier Part: C50933; Manufacturer: HANRUN(汉仁); Supplier Footprint: 插件; JLCPCB Part Class: 扩展库; Datasheet: https://atta.szlcsc.com/upload/public/pdf/source/20240108/FEC80AF9B295891E58BF4ACD53537D33.pdf; Supplier: LCSC; Connector Type: RJ45插座; Number of Ports: 1; Mounting Style: 弯插; Shielding: 有屏蔽; LED: 带LED
L20 = FTC252012S2R2MBCA: 电感值:2.2uH;精度:±20%;额定电流:3A;饱和电流(Isat):3.8A;类型:一体成型电感;; LCSC Part Name: 2.2uH ±20% 3.8A; Supplier Part: C5832372; Manufacturer: cjiang(长江微电); Supplier Footprint: 1008; JLCPCB Part Class: 扩展库; Datasheet: https://atta.szlcsc.com/upload/public/pdf/source/20230602/8FFEDA9C0247A92A0D4B67554BFE4091.pdf; Supplier: LCSC; Tolerance: ±20%; Rated Current: 3A; Saturation Current (Isat): 3.8A; DC Resistance (DCR): 55mΩ; Type: 一体成型电感
R4 R26 R28 R30 R31 R353 R355 R360 R363 = Res_0402: Supplier Footprint: 0402; Comment: DNP
U50 = RTL8211F-CG
X2 = X322525MOB4SI: 晶振类型:贴片晶振;频率:25MHz;常温频差:±10ppm;负载电容:12pF;频率稳定度:±20ppm;; LCSC Part Name: YSX321SL 25MHZ 4P 3225 12PF ±10PPM -40~85℃ (±20PPM); Supplier Part: C9006; Manufacturer: YXC(扬兴晶振); Supplier Footprint: SMD3225-4P; JLCPCB Part Class: 基础库; Datasheet: https://item.szlcsc.com/datasheet/X322525MOB4SI/9526.html; Supplier: LCSC; Type: 贴片晶振; Normal temperature Frequency Tolerance: ±10ppm; Load Capacitance: 12pF; Frequency Stability: ±20ppm; Operating Temperature: -40℃~+85℃
C73 C74 C77-C81 C86-C90 C92 C93 C95-C97 C105-C107 C113 C114 C117 C118 = CL05A105KP5NNNC: 容值:1uF;精度:±10%;额定电压:10V;材质(温度系数):X5R;; LCSC Part Name: 1uF ±10% 10V; Supplier Part: C14445; Manufacturer: SAMSUNG(三星); Supplier Footprint: 0402; JLCPCB Part Class: 扩展库; Datasheet: https://atta.szlcsc.com/upload/public/pdf/source/20160103/1457707670698.pdf; Supplier: LCSC; Tolerance: ±10%; Voltage Rated: 10V; Temperature Coefficient: X5R
C109 = CL05A475MQ5NRNC: 容值:4.7uF;精度:±20%;额定电压:6.3V;材质(温度系数):X5R;; LCSC Part Name: 4.7uF ±20% 6.3V; Supplier Part: C307423; Manufacturer: SAMSUNG(三星); Supplier Footprint: 0402; JLCPCB Part Class: Extended Part; Datasheet: https://atta.szlcsc.com/upload/public/pdf/source/20181010/C307423_0E0C4E35F3A09F81C2E5C84E00499E42.pdf; Supplier: LCSC; Tolerance: ±20%; Voltage Rated: 6.3V; Temperature Coefficient: X5R
C111 C115 C119 C122 = CAP_0402: Supplier Footprint: 0402
C112 C116 = 0402CG120J500NT: 容值:12pF;精度:±5%;额定电压:50V;材质(温度系数):C0G;; LCSC Part Name: 12pF ±5% 50V; Supplier Part: C1547; Manufacturer: FH(风华); Supplier Footprint: 0402; JLCPCB Part Class: Basic Part; Datasheet: https://atta.szlcsc.com/upload/public/pdf/source/20200305/C486355_26A10D38EF8C2A5C37091D0039909270.pdf; Supplier: LCSC; Tolerance: ±5%; Voltage Rated: 50V; Temperature Coefficient: C0G
C120 C121 = 0402B681K500NT: 容值:680pF;精度:±10%;额定电压:50V;材质(温度系数):X7R;; LCSC Part Name: 680pF ±10% 50V; Supplier Part: C1541; Manufacturer: FH(风华); Supplier Footprint: 0402; JLCPCB Part Class: Extended Part; Datasheet: https://atta.szlcsc.com/upload/public/pdf/source/20170923/C1541_1506149263051988348.pdf; Supplier: LCSC; Tolerance: ±10%; Voltage Rated: 50V; Temperature Coefficient: X7R
C123 C129 = CL05B104KO5NNNC: 容值:100nF;精度:±10%;额定电压:16V;材质(温度系数):X7R;; LCSC Part Name: 100nF ±10% 16V; Supplier Part: C1525; Manufacturer: SAMSUNG(三星); Supplier Footprint: 0402; JLCPCB Part Class: 基础库; Datasheet: https://atta.szlcsc.com/upload/public/pdf/source/20160103/1457707674891.pdf; Supplier: LCSC; Tolerance: ±10%; Voltage Rated: 16V; Temperature Coefficient: X7R
C124 C125 = 0402CG270J500NT: 容值:27pF;精度:±5%;额定电压:50V;材质(温度系数):C0G;; LCSC Part Name: 27pF ±5% 50V; Supplier Part: C1557; Manufacturer: FH(风华); Supplier Footprint: 0402; JLCPCB Part Class: Basic Part; Datasheet: https://atta.szlcsc.com/upload/public/pdf/source/20170923/C1557_1506149270123988364.pdf; Supplier: LCSC; Tolerance: ±5%; Voltage Rated: 50V; Temperature Coefficient: C0G
D1 = BAT54C,215: 二极管配置:1对共阴极;正向压降(Vf):800mV@100mA;直流反向耐压(Vr):30V;整流电流:200mA;; LCSC Part Name: 电压:30V 电流:200mA; Supplier Part: C37704; Manufacturer: Nexperia(安世); Supplier Footprint: SOT-23; JLCPCB Part Class: 扩展库; Datasheet: https://item.szlcsc.com/datasheet/BAT54C%252C215/38684.html; Supplier: LCSC; Diode Configuration: 1对共阴极; Voltage - Forward(Vf@If): 800mV@100mA; Voltage - DC Reverse(Vr): 30V; Current - Rectified: 200mA; Reverse Leakage Current (Ir): 2uA@25V; Non-Repetitive Peak Forward Surge Current: 600mA
H5 = HDR-M_2.54_1x2P: Supplier Part: C124375; Supplier Footprint: 插件
L1-L5 = MCS20FC-R47MHC: 电感值:470nH;精度:±20%;额定电流:4.05A;; LCSC Part Name: 470nH ±20% 4.05A 23mΩ; Supplier Part: C375941; Manufacturer: PSA(信昌电陶); Supplier Footprint: SMD; JLCPCB Part Class: 扩展库; Datasheet: https://atta.szlcsc.com/upload/public/pdf/source/20190312/C375941_0FA6931C341ECE1823B3912EFF81D587.pdf; Supplier: LCSC; Tolerance: ±20%; Rated Current: 4.05A; DC Resistance (DCR): 23mΩ
L6 = BLM15AG121SN1D: 标称阻抗@测试频率:120Ω@100MHz;误差:±25%;直流电阻(RDC):250mΩ;额定电流:500mA;电路数:1;; LCSC Part Name: 120Ω@100MHz ±25%; Supplier Part: C85812; Manufacturer: muRata(村田); Supplier Footprint: 0402; JLCPCB Part Class: Extended Part; Datasheet: https://atta.szlcsc.com/upload/public/pdf/source/20180326/C85812_709B7ABD18A92BCC8FFBD7A231EEE264.pdf; Supplier: LCSC; Impedance @ Frequency: 120Ω@100MHz; Tolerance: ±25%; DC Resistance: 250mΩ; Current Rating: 500mA; Circuits: 1
L7 L9 L11 L12 = BLM18PG121SN1D: 标称阻抗@测试频率:120Ω@100MHz;误差:±25%;直流电阻(RDC):50mΩ;; LCSC Part Name: 单路 0603磁珠 阻抗120Ω@100MHz; Supplier Part: C14709; Manufacturer: muRata(村田); Supplier Footprint: 0603; JLCPCB Part Class: 基础库; Datasheet: https://atta.szlcsc.com/upload/public/pdf/source/20130704/1457706621422.pdf; Supplier: LCSC; Impedance @ Frequency: 120Ω@100MHz; Tolerance: ±25%; DC Resistance: 50mΩ; Current Rating: 2A; Circuits: 1
L8 L10 = BLM18PG181SN1D: 标称阻抗@测试频率:180Ω@100MHz;误差:±25%;直流电阻(RDC):90mΩ;额定电流:1.5A;电路数:1;; LCSC Part Name: 180Ω@100MHz ±25%; Supplier Part: C82850; Manufacturer: muRata(村田); Supplier Footprint: 0603; JLCPCB Part Class: Extended Part; Datasheet: https://atta.szlcsc.com/upload/public/pdf/source/20180326/C82850_BC876320DC99E3923AFD377E2F9C4AED.pdf; Supplier: LCSC; Impedance @ Frequency: 180Ω@100MHz; Tolerance: ±25%; DC Resistance: 90mΩ; Current Rating: 1.5A; Circuits: 1
R50 R51 R53 = 0402WGF1000TCE: Supplier: LCSC; Supplier Part: C25076; Supplier Footprint: 0402; JLCPCB Part Class: Basic Part; LCSC Part Name: 100Ω(1000) ±1% 编带; Datasheet: https://atta.szlcsc.com/upload/public/pdf/source/20170920/C25076_1505901197574982707.pdf; Manufacturer: UNI-ROYAL(厚声)
R52 R54 R57 R61 = ERJ2GE0R00X: 电阻类型:-;阻值:0Ω;功率:100mW;温度系数:-100ppm/℃~+600ppm/℃;最大工作电压:-;工作温度范围:-55℃~+155℃;; LCSC Part Name: 0Ω 100mW; Supplier Part: C242160; Manufacturer: PANASONIC(松下); Supplier Footprint: 0402; JLCPCB Part Class: 扩展库; Datasheet: https://atta.szlcsc.com/upload/public/pdf/source/20181106/C242160_CA6E41971DE5A1DCD79442F3CF334CD6.pdf; Supplier: LCSC; Power(Watts): 100mW; Temperature Coefficient: -100ppm/℃~+600ppm/℃; Operating Temperature Range: -55℃~+155℃
R55 = 0402WGF4702TCE: 电阻类型:厚膜电阻;阻值:47kΩ;精度:±1%;功率:62.5mW;温度系数:±100ppm/℃;最大工作电压:50V;工作温度范围:-55℃~+155℃;; LCSC Part Name: 47kΩ ±1% 62.5mW; Supplier Part: C25792; Manufacturer: UNI-ROYAL(厚声); Supplier Footprint: 0402; JLCPCB Part Class: Basic Part; Datasheet: https://atta.szlcsc.com/upload/public/pdf/source/20200306/C422600_1E6D84923E4A46A82E41ADD87F860B5C.pdf; Supplier: LCSC; Type: 厚膜电阻; Tolerance: ±1%; Power(Watts): 62.5mW; Temperature Coefficient: ±100ppm/℃; Overload Voltage (Max): 50V; Operating Temperature Range: -55℃~+155℃
R56 = 0402WGF1203TCE: 电阻类型:厚膜电阻;阻值:120kΩ;精度:±1%;功率:62.5mW;温度系数:±100ppm/℃;最大工作电压:50V;工作温度范围:-55℃~+155℃;; LCSC Part Name: 120kΩ ±1% 62.5mW; Supplier Part: C25750; Manufacturer: UNI-ROYAL(厚声); Supplier Footprint: 0402; JLCPCB Part Class: Basic Part; Datasheet: https://atta.szlcsc.com/upload/public/pdf/source/20200306/C422600_1E6D84923E4A46A82E41ADD87F860B5C.pdf; Supplier: LCSC; Type: 厚膜电阻; Tolerance: ±1%; Power(Watts): 62.5mW; Temperature Coefficient: ±100ppm/℃; Overload Voltage (Max): 50V; Operating Temperature Range: -55℃~+155℃
R58 = ERJ2GE0R00X: 电阻类型:-;阻值:0Ω;功率:100mW;温度系数:-100ppm/℃~+600ppm/℃;最大工作电压:-;工作温度范围:-55℃~+155℃;; LCSC Part Name: 0Ω 100mW; Manufacturer: PANASONIC(松下); Supplier Footprint: 0402; JLCPCB Part Class: 扩展库; Datasheet: https://atta.szlcsc.com/upload/public/pdf/source/20181106/C242160_CA6E41971DE5A1DCD79442F3CF334CD6.pdf; Supplier: LCSC; Power(Watts): 100mW; Temperature Coefficient: -100ppm/℃~+600ppm/℃; Operating Temperature Range: -55℃~+155℃
R59 = RC0402FR-07180KL: 电阻类型:厚膜电阻;阻值:180kΩ;精度:±1%;功率:62.5mW;温度系数:±100ppm/℃;最大工作电压:50V;工作温度范围:-55℃~+155℃;; LCSC Part Name: 180kΩ ±1% 62.5mW; Supplier Part: C138046; Manufacturer: YAGEO(国巨); Supplier Footprint: 0402; JLCPCB Part Class: Extended Part; Datasheet: https://atta.szlcsc.com/upload/public/pdf/source/20171107/C138046_15100516638711096969.pdf; Supplier: LCSC; Type: 厚膜电阻; Tolerance: ±1%; Power(Watts): 62.5mW; Temperature Coefficient: ±100ppm/℃; Overload Voltage (Max): 50V; Operating Temperature Range: -55℃~+155℃
R60 R63 = CRCW040210K0FKED: 电阻类型:厚膜电阻;阻值:10kΩ;精度:±1%;功率:63mW;温度系数:±100ppm/K;最大工作电压:50V;工作温度范围:-55℃~+155℃;; LCSC Part Name: 10kΩ ±1% 63mW; Supplier Part: C71617; Manufacturer: VISHAY(威世); Supplier Footprint: 0402; JLCPCB Part Class: 扩展库; Datasheet: https://atta.szlcsc.com/upload/public/pdf/source/20180224/C71617_15194370300791364062.pdf; Supplier: LCSC; Type: 厚膜电阻; Tolerance: ±1%; Power(Watts): 63mW; Temperature Coefficient: ±100ppm/K; Overload Voltage (Max): 50V; Operating Temperature Range: -55℃~+155℃
R62 = 0402WGF5602TCE: 精度:±1%;功率:1/16W;温度系数:±100ppm/℃;阻值:56kΩ;最大工作电压:50V;工作温度范围:-55℃~+155℃;; LCSC Part Name: 56KΩ ±1%; Supplier Part: C25796; Manufacturer: UNI-ROYAL(厚声); Supplier Footprint: 0402; JLCPCB Part Class: Basic Part; Datasheet: https://atta.szlcsc.com/upload/public/pdf/source/20170920/C25796_1505901547482983369.pdf; Supplier: LCSC; Tolerance: ±1%; Power(Watts): 1/16W; Temperature Coefficient: ±100ppm/℃; Overload Voltage (Max): 50V; Operating Temperature Range: -55℃~+155℃
U5 = RK809-5
X1 = XKXGI-SUA-32.768K: 频率:32.768kHz;频率公差:±20ppm;负载电容:12.5pF;; LCSC Part Name: 32.768kHz ±20ppm 12.5pF YST310S; Supplier Part: C5213671; Manufacturer: YXC(扬兴晶振); Supplier Footprint: SMD3215-2P; JLCPCB Part Class: Extended Part; Datasheet: https://atta.szlcsc.com/upload/public/pdf/source/20221026/C961783E7D3E186CA8CEB40DFC46D85F.pdf; Supplier: LCSC; Crystal Type: 贴片无源晶振; Frequency Tolerance: ±20ppm; Load Capacitance: 12.5pF; Operating Temperature: -40℃~+85℃; Equivalent Series Resistance (ESR): 70kΩ

## Nets
GND: C55.2 C59.2 C62.2 C65.2 C67.2 C73.1 C74.2 C75.1 C76.1 C77.2 C78.2 C79.1 C80.2 C82.1 C83.1 C84.2 C85.2 C87.2 C88.2 C89.1 C90.2 C91.1 C92.2 C93.2 C94.1 C95.1 C96.2 C98.2 C99.1 C101.2 C102.1 C103.2 C104.1 C105.1 C106.1 C107.2 C111.1 C112.1 C113.1 C114.1 C115.1 C116.2 C117.1 C118.1 C119.1 C120.1 C121.1 C122.1 C124.1 C125.1 C126.1 C127.1 C128.2 C130.1 C131.1 C134.1 C135.2 C136.2 C137.1 C138.1 C194.2 C195.1 C196.2 C199.2 C203.1 C204.2 C206.2 C207.2 C215.2 C216.2 C217.2 C218.2 C336.1 C339.1 C341.1 C345.1 C346.2 C347.1 C348.2 C349.2 C350.2 C351.1 C352.2 C353.2 C354.2 C355.2 C356.2 C359.2 C360.2 C361.2 C363.2 C364.2 C537.2 C538.1 C539.1 C540.1 D6.1(A) H5.2 R7.1 R24.1 R26.1 R28.1 R30.1 R31.2 R44.2 R56.1 R58.2 R62.1 R69.1 R79.2 R85.1 R164.1 R167.1 R344.1 R345.2 R352.1 R353.1 R354.1 R357.1 R360.1 U2.B2(GND) U2.B3(GND) U2.B4(AGND) U2.C1(GND) U2.C2(GND) U2.C3(GND) U2.C4(GND) U5.47(GNDREF) U5.56(BATDIV) U5.62(SNSP) U5.63(SNSN) U5.69(EPAD) U7.2(GND) U15.11(GND) U26.2(GND) U27.6(GND) U27.9(PowerPAD) U50.41(E-PAD) USB1.1(EP) USB1.2(EP) USB1.3(EP) USB1.4(EP) USB1.A1(GND) USB1.A12(GND) USB1.B1(GND) USB1.B12(GND) X2.2(GND) X2.4(GND) ; also on sheet 1 4 5 6 7 8 9 10 11 12 13 14 15 16 17 18 19 20 21 22 23 24
VBUS12V: C539.2 C540.2 U16.2 U27.7(VIN)
VBUS12V_IN: R45.1 R46.2 U16.1 USB1.A4(VBUS) USB1.A9(VBUS) USB1.B4(VBUS) USB1.B9(VBUS)
VCC0V6_DDR: C205.2 C206.1 C207.1 L17.2 R38.2 R78.1 ; also on sheet 6 18
VCC1V8_DDR: R77.2 ; also on sheet 6
VCC3V0_RTC: D1.1(A) H5.1
VCC3V3_PHY0: C136.1 C194.1 C359.1 C360.1 C361.1 R4.1 R343.1 R355.2 R356.2 R361.2 U50.11(AVDD33) U50.29(DVDD33) U50.40(AVDD33)
VCC3V3_PMU: C88.1 R63.1 R66.2 R67.2 U5.31(LDO6) ; also on sheet 5
VCC3V3_SD: C96.1 U5.58(SWOUT2) ; also on sheet 12
VCC3V3_SYS: C65.1 C73.2 C75.2 C79.2 C89.2 C91.2 C95.2 C102.2 C196.1 C203.2 C338.2 C339.2 D1.2(A) L18.2 R168.2 R361.1 U5.4(VCC7) U5.10(VCC2) U5.11(VCC1) U5.22(VCC5) U5.24(VCC3) U5.30(VCC6) U5.54(VCC9) U5.57(VCC8) U5.66(VCC4) U7.4(IN) ; also on sheet 4 11 13 15
VCC-5V: C130.2 C131.2 C195.2 C341.2 C537.1 C538.2 L6.1 L14.2 R59.2 R166.2 R374.2 U2.D1(VIN) U2.D2(VIN) U2.E1(VIN) U2.E2(VIN) U26.5(IN) ; also on sheet 8 9 10 15 17
VCC_1V8: C103.1 C104.2 L5.2 R52.1 R57.2 R68.1 R362.1 ; also on sheet 14 15 20
VCC_3V3: C67.1 R54.1 R363.1 U5.55(SWOUT1) ; also on sheet 9 12 14 15 20 22 24
VCC_DDR: C99.2 C101.1 L4.2 R38.1 R55.1 U5.26(VBUCK3) ; also on sheet 6 18
VCCA1V8_IMAGE: C93.1 C122.2 L12.1 U5.6(LDO9) ; also on sheet 19
VCCA1V8_PMU: C92.1 U5.5(LDO8) ; also on sheet 5 6
VCCA_1V8: C90.1 C115.2 L9.1 U5.3(LDO7) ; also on sheet 5 14 22
VCCIO_ACODEC: C80.1 U5.28(LDO4) ; also on sheet 16 21
VCCIO_FLASH: C138.2 R68.2 ; also on sheet 7 24
VCCIO_PHY0: C135.1 C363.1 C364.1 R25.2 R29.2 R342.1 R358.2 R359.2 R362.2 R363.2 U50.28(DVDD_RG)
VCCIO_SD: C87.1 U5.29(LDO5) ; also on sheet 7
VCCIO_WL: C105.2 R52.2 R54.2 R60.1 ; also on sheet 14
VDD10_PHY0: C351.2 C352.1 C353.1 C354.1 C355.1 C356.1 L20.2 U50.3(AVDD10) U50.8(AVDD10) U50.21(DVDD10) U50.38(AVDD10)
VDD_CPU: C55.1 C59.1 C62.1 C132.2 C134.2 C215.1 C216.1 C217.1 C218.1 L13.2 R65.2 ; also on sheet 23
VDD_CPU_COM: C132.1 R65.1 U2.A4(VOUT) ; also on sheet 23
VDD_GPU: C94.2 C97.1 C97.2 C98.1 L3.1 R53.1 R53.2 U5.8(FB2) ; also on sheet 23
VDD_LOGIC: C81.1 C81.2 C82.2 C84.1 L1.1 R50.1 R50.2 U5.13(FB1) ; also on sheet 23
VDD_NPU: C83.2 C85.1 C86.1 C86.2 L2.2 R51.1 R51.2 U5.64(FB4) ; also on sheet 23
VDDA0V9_IMAGE: C74.1 C119.2 L11.1 U5.23(LDO1) ; also on sheet 19
VDDA0V9_PMU: C78.1 U5.20(LDO3) ; also on sheet 5
VDDA_0V9: C77.1 C111.2 L7.1 U5.21(LDO2) ; also on sheet 5 22
CC1: U15.7(CC1) USB1.A5(CC1)
CC2: U15.6(CC2) USB1.B5(CC2)
FLASH_VOL_SEL: R67.1 R69.2 ; also on sheet 5
GMAC0_INT/PMEB_GPIO3_C0: U50.31(INT) ; also on sheet 20
GMAC0_MCLKINOUT: C350.1 R6.1 R7.2 ; also on sheet 14
GMAC0_MDC: U50.13(MDC) ; also on sheet 14
GMAC0_MDIO: R342.2 U50.14(MDIO) ; also on sheet 14
GMAC0_RSTN_GPIO3_B7: R5.1 ; also on sheet 20
GMAC0_RXCLK: R350.2 ; also on sheet 14
GMAC0_RXD0: R346.2 ; also on sheet 14
GMAC0_RXD1: R347.2 ; also on sheet 14
GMAC0_RXD2: R348.2 ; also on sheet 14
GMAC0_RXD3: R349.2 ; also on sheet 14
GMAC0_RXDV_CRS: R351.2 ; also on sheet 14
GMAC0_TXCLK: U50.20(TXCLK) ; also on sheet 14
GMAC0_TXD0: U50.18(TXD0) ; also on sheet 14
GMAC0_TXD1: U50.17(TXD1) ; also on sheet 14
GMAC0_TXD2: U50.16(TXD2) ; also on sheet 14
GMAC0_TXD3: U50.15(TXD3) ; also on sheet 14
GMAC0_TXEN: U50.19(TXCTL) ; also on sheet 14
HP_L: U5.39(HPL_OUT) ; also on sheet 16
HP_R: U5.41(HPR_OUT) ; also on sheet 16
HP_SNS: U5.40(HP_SNS) ; also on sheet 16
I2C0_SCL_PMIC: U2.A3(SCL) U5.1(SCL) ; also on sheet 5
I2C0_SDA_PMIC: U2.B1(SDA) U5.2(SDA) ; also on sheet 5
I2S1_LRCK_TX_M0_RK809: U5.14(LRCLK) ; also on sheet 21
I2S1_MCLK_M0_RK809: U5.16(MCLK) ; also on sheet 21
I2S1_SCLK_TX_M0_RK809: U5.15(BCLK) ; also on sheet 21
I2S1_SDI0_M0/PDM_SDI0_M0_RK809: U5.18(SDO/PDMDATA) ; also on sheet 21
I2S1_SDO0_M0_RK809: U5.17(SDI) ; also on sheet 21
IND_LX_FB/OUT: C205.1 R78.2 R79.1 U7.5(FB)
MIC1_INN: C129.2
MIC1_INP: C123.2 ; also on sheet 16
MIPI_AVDD_0V9: L11.2 ; also on sheet 1 19
MIPI_AVDD_1V8: L12.2 ; also on sheet 1 19
PDM_CLK0_M0_RK809: U5.19(PDMCLK) ; also on sheet 21
PHY0_CHASSIS_GND: C345.2 L19.P10 L19.SHIELD0 L19.SHIELD1
PHY0_CLKOUT125: R6.2 U50.35(CLKOUT)
PHY0_LED0/CFG_EXT: R352.2 R355.1 U50.32(LED0_CFG_EXT)
PHY0_LED1/CFG_LDO0: L19.11 R354.2 U50.33(LED1_CFG_LD0)
PHY0_LED2/CFG_LDO1: L19.13 R353.2 R356.1 U50.34(LED2_CFG_LDO1)
PHY0_MDI_0+: L19.P2(MDI0+) U50.1(MDIP0)
PHY0_MDI_0-: L19.P3(MDI0-) U50.2(MDIN0)
PHY0_MDI_1+: L19.P4(MDI1+) U50.4(MDIP1)
PHY0_MDI_1-: L19.P7(MDI1-) U50.5(MDIN1)
PHY0_MDI_2+: L19.P5(MDI2+) U50.6(MDIP2)
PHY0_MDI_2-: L19.P6(MDI2-) U50.7(MDIN2)
PHY0_MDI_3+: L19.P8(MDI3+) U50.9(MDIP3)
PHY0_MDI_3-: L19.P9(MDI3-) U50.10(MDIN3)
PHY0_REG_OUT: L20.1 U50.30(REG_OUT)
PHY0_RSTN: C347.2 R4.2 R5.2 U50.12(PHYRSTB)
PHY0_RXCLK/PHYAD1: R24.2 R350.1 R359.1 U50.27(RXCLK_PHYAD1)
PHY0_RXD0/RXDLY: R25.1 R26.2 R346.1 U50.25(RXD0_RXDLY)
PHY0_RXD1/TXDLY: R28.2 R31.1 R347.1 U50.24(RXD1_TXDLY)
PHY0_RXD2/PLLOFF: R29.1 R30.2 R348.1 U50.23(RXD2_PLLOFF)
PHY0_RXD3/PHYAD0: R349.1 R358.1 R360.2 U50.22(RXD3_PHYAD0)
PHY0_RXDV/PHYAD2: R351.1 R357.2 U50.26(RXCTL_PHYAD2)
PHY0_XTALIN: C349.1 U50.36(XTAL_IN) X2.3(OSC2)
PHY0_XTALOUT: C348.1 U50.37(XTAL_OUT_EXT_CLK) X2.1(OSC1)
PMIC_32KOUT_WIFI: R60.2 R61.1
PMIC_INT_L: U5.7(INT) ; also on sheet 5
PMIC_PWRON: C128.1 U5.52(PWRON) ; also on sheet 4
PMIC_RESET_KEY: R64.1 ; also on sheet 4
PMIC_SLEEP_H: U2.A1(VSEL) U5.49(SLEEP) ; also on sheet 5
RESETN: C127.2 R63.2 R64.2 U5.67(RESETB)
SPKN_OUT: C121.2 L8.2 ; also on sheet 16
SPKP_OUT: C120.2 L10.2 ; also on sheet 16
USB_AVDD_0V9: L7.2 ; also on sheet 22
USB_AVDD_1V8: L9.2 ; also on sheet 22
$8N4261: C126.2 R59.1 R62.2 U5.61(VDC)
$8N4264: C107.1 D1.3(K) U5.45(VCC_RTC)
$8N4267: R55.2 R56.2 U5.27(FB3)
$8N4303: C117.2 U5.48(VCC_1P8D)
$8N4304: C118.2 U5.44(VCC_1P8A)
$8N4312: C125.2 C129.1 U5.42(MIC1n)
$8N4313: C123.1 C124.2 U5.43(MIC1p)
$8N4324: L10.1 U5.32(SPK_OUTp)
$8N4327: L8.1 U5.34(SPK_OUTn)
$8N4341: L5.1 U5.53(SW5)
$8N4368: C109.2 U5.37(CPp)
$8N4369: C113.2 U5.38(VCC_CPVDD)
$8N4370: C114.2 U5.35(VCC_CPVSS)
$8N4372: C76.2 L6.2 U5.33(VCC_SPK_HP)
$8N4373: C109.1 U5.36(CPn)
$8N4375: L4.1 U5.25(SW3)
$8N4377: L2.1 U5.65(SW4)
$8N4396: C112.2 U5.50(XIN) X1.2
$8N4405: R61.2 U5.68(CLK32K)
$8N4407: C116.1 U5.51(XOUT) X1.1
$8N4412: L1.2 U5.12(SW1)
$8N4415: L3.2 U5.9(SW2)
$8N4418: C106.2 U5.46(VREF)
$9N3946: C137.2 R66.1 U2.A2(EN)
$9N3953: L13.1 U2.D3(SW_1) U2.D4(SW_2) U2.E3(SW_3) U2.E4(SW_4)
$9N6747: C204.1 R77.1 U7.1(EN)
$9N6749: L17.1 U7.3(LX)
$9N8088: C338.1 R167.2 R168.1 U26.3(FB)
$9N8092: C336.2 R164.2 R166.1 U26.4(EN)
$9N8093: C337.1 L18.1 U26.6(LX)
$9N8094: C337.2 U26.1(BS)
$9N9917: C536.2 D6.2(K) L14.1 U27.8(PH)
$9N9926: C536.1 U27.1(BOOT)
$9N9931: R85.2 R374.1 U27.4(VSENSE)
$9N9941: C199.1 R45.2 U15.1(VDD)
$9N9944: R44.1 U15.9(CFG1)
$9N9946: R46.1 U15.8(VBUS)
$9N9950: U15.4(DP) U15.5(DM)
$22N2405: C346.1 L19.P1
$22N2505: R345.1 U50.39(RSET)
$22N2549: L19.14 R343.2
$22N2556: L19.12 R344.2
Net-(R57-1): R57.1 R58.1 U5.59(FB5)

Not connected (* = marked no-connect by the designer): U5 60(EXT_EN)*; U15 2(CFG2)* 3(CFG3)* 10(PG)*; U27 2(NC)* 3(NC)* 5(ENA)*; USB1 A6(DP1) A7(DN1) A8(SBUS1) B6(DP2) B7(DN2) B8(SBUS2)

## Notes on the sheets
sheet 25
- 默认关闭
- VCCIO_WL
- The resistor parameter is 47KR ±1%
- Default:1.1V
- PMIC RK809 DCDC
- PMIC RK809 LDO
- PMIC RK809 Managerment
- PMIC RK809 CODEC
- SNS要被左右声道包围
- 支持1.3W音频输出
- 可以给以太网 WiFi提供时钟
- 晶振输出是开漏模式
- If RK809-5 codec is not used,
  then Pin 14,15,16,17,19,40 Tie VSS
  Pin 18,36,37,38,35,39,41,34,32,43,42
  Leave floating
- 1.2V
sheet 26
- VDD_CPU 是给内部arm Cortex-A55(4 核) core供电
  电流要求4A
  使用额外TCS4525供电
- 采样IO
- FLASH_VOL_SEL
  VCC_IO2的电压选择
  上拉 -> 1.8V eMMC
  下拉 -> 3.3V Flash
- DNP
- VCC_LPDDR4_VCC
- NC
- ETA3409A/TCS4201:1.0uH/2A
  SY8089AAAC:2.2uH/2A
- 后续请勿更新库，相关管脚会修改。
- Default: LPDDR4=1.1V
sheet 27
- 不焊接
- 默认1.8V电源域
- 不焊接
- VCC_PHY0_IO Voltage Config
- 不焊接
- 不焊接
- 125M 时钟输出
- PHY Address Config
- 1 (default) 3'b001
- 不焊接
- Pull-up for additional 2ns delay to RXC for data latching
- 不焊接
- Pull-up for additional 2ns delay to TXC for data latching
- 不焊接
- Pull-up to disable PLL @ ALDPS mode(Low power mode)
- Close to PIN28
- 不焊接
- 不焊接
- Close to PIN11,40
- Close to PIN21
- Close to PIN29
- Close to PIN3,8,38
